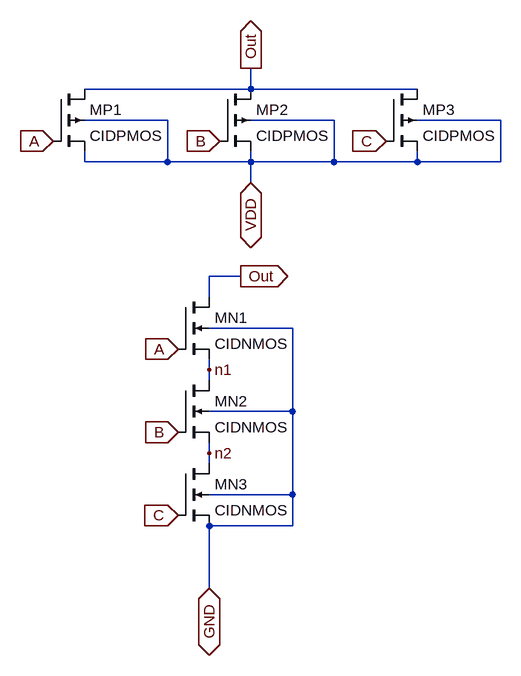
[diagram p0: schematic NAND3X1.asc]
NAND3X1.asc, the LTspice schematic file:
Version 4.1
SHEET 1 880 784
WIRE 48 -96 48 -128
WIRE 48 -96 -208 -96
WIRE 304 -96 48 -96
WIRE -80 -48 -208 -48
WIRE 176 -48 48 -48
WIRE 432 -48 304 -48
WIRE -208 16 -208 0
WIRE -80 16 -80 -48
WIRE -80 16 -208 16
WIRE 48 16 48 0
WIRE 48 16 -80 16
WIRE 176 16 176 -48
WIRE 176 16 48 16
WIRE 304 16 304 0
WIRE 304 16 176 16
WIRE 432 16 432 -48
WIRE 432 16 304 16
WIRE 48 48 48 16
WIRE 32 192 -16 192
WIRE -16 224 -16 192
WIRE 112 272 -16 272
WIRE -16 336 -16 320
WIRE -16 352 -16 336
WIRE 112 400 112 272
WIRE 112 400 -16 400
WIRE -16 464 -16 448
WIRE -16 480 -16 464
WIRE 112 528 112 400
WIRE 112 528 -16 528
WIRE 112 576 112 528
WIRE 112 576 -16 576
WIRE -16 672 -16 576
FLAG -64 304 A
IOPIN -64 304 In
FLAG -64 432 B
IOPIN -64 432 In
FLAG -64 560 C
IOPIN -64 560 In
FLAG 32 192 Out
IOPIN 32 192 Out
FLAG -16 672 GND
IOPIN -16 672 BiDir
FLAG 48 48 VDD
IOPIN 48 48 BiDir
FLAG -16 336 n1
FLAG -16 464 n2
FLAG -256 -16 A
IOPIN -256 -16 In
FLAG 0 -16 B
IOPIN 0 -16 In
FLAG 256 -16 C
IOPIN 256 -16 In
FLAG 48 -128 Out
IOPIN 48 -128 Out
SYMBOL pmos4 -256 -96 R0
SYMATTR InstName MP1
SYMATTR Value CIDPMOS
SYMATTR Value2 l=5u w=50u
SYMBOL pmos4 0 -96 R0
SYMATTR InstName MP2
SYMATTR Value CIDPMOS
SYMATTR Value2 l=5u w=50u
SYMBOL pmos4 256 -96 R0
SYMATTR InstName MP3
SYMATTR Value CIDPMOS
SYMATTR Value2 l=5u w=50u
SYMBOL nmos4 -64 224 R0
SYMATTR InstName MN1
SYMATTR Value CIDNMOS
SYMATTR Value2 l=5u w=30u
SYMBOL nmos4 -64 352 R0
SYMATTR InstName MN2
SYMATTR Value CIDNMOS
SYMATTR Value2 l=5u w=30u
SYMBOL nmos4 -64 480 R0
SYMATTR InstName MN3
SYMATTR Value CIDNMOS
SYMATTR Value2 l=5u w=30u

The netlist it stands for:
* NAND3X1.asc
MP1 Out A VDD VDD CIDPMOS l=5u w=50u
MP2 Out B VDD VDD CIDPMOS l=5u w=50u
MP3 Out C VDD VDD CIDPMOS l=5u w=50u
MN1 Out A n1 GND CIDNMOS l=5u w=30u
MN2 n1 B n2 GND CIDNMOS l=5u w=30u
MN3 n2 C GND GND CIDNMOS l=5u w=30u
.model NMOS NMOS
.model PMOS PMOS
.lib standard.mos
.backanno
.end